# Altium schematic sheet NB2DSK_Mounts.SchDoc: NB2DSK01 Holes and Graphics
size A4; Organization: Altium Limited.; Address1: Level 3, 12a Rodborough Rd; Address2: Frenchs Forest 2086; Address3: NSW; Address4: AUSTRALIA; DocumentNumber: 38; Revision: 6; SheetNumber: 38; SheetTotal: 64
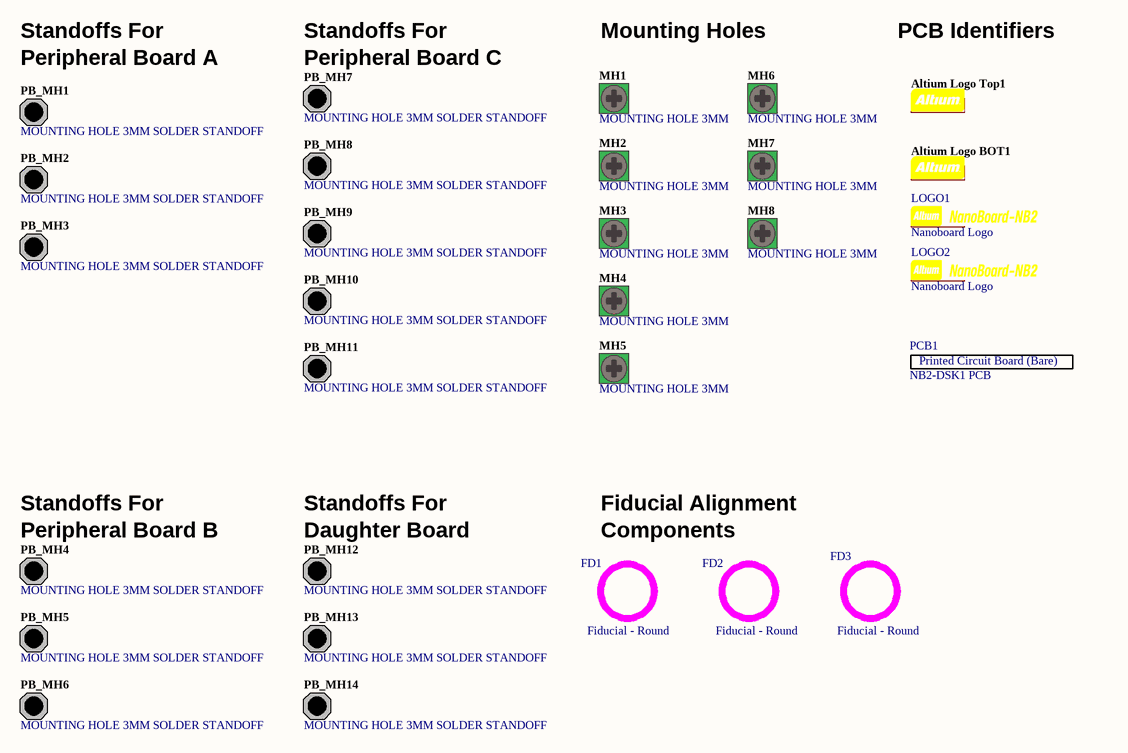
[diagram p0: NB2DSK_Mounts.SchDoc]

## Parts
Altium_Logo_BOT1  Altium  [Logo-Altium]  (value not drawn)  (no BOM)
Altium_Logo_Top1  Altium  [Logo-Altium]  (value not drawn)  (no BOM)
FD1  Fiducial - Round  [FIDUCIAL ROUND]
FD2  Fiducial - Round  [FIDUCIAL ROUND]
FD3  Fiducial - Round  [FIDUCIAL ROUND]
LOGO1  Nanoboard Logo  [NANOBOARD LOGO]  (no BOM)
LOGO2  Nanoboard Logo  [NANOBOARD LOGO]  (no BOM)
MH1  MOUNTING HOLE 3MM  [MOUNTING_HOLE_3MM]  (no BOM)
MH2  MOUNTING HOLE 3MM  [MOUNTING_HOLE_3MM]  (no BOM)
MH3  MOUNTING HOLE 3MM  [MOUNTING_HOLE_3MM]  (no BOM)
MH4  MOUNTING HOLE 3MM  [MOUNTING_HOLE_3MM]  (no BOM)
MH5  MOUNTING HOLE 3MM  [MOUNTING_HOLE_3MM]  (no BOM)
MH6  MOUNTING HOLE 3MM  [MOUNTING_HOLE_3MM]  (no BOM)
MH7  MOUNTING HOLE 3MM  [MOUNTING_HOLE_3MM]  (no BOM)
MH8  MOUNTING HOLE 3MM  [MOUNTING_HOLE_3MM]  (no BOM)
PB_MH1  MOUNTING HOLE 3MM SOLDER STANDOFF  [STANDOFF_SOLDER_3MM]  (no BOM)
PB_MH2  MOUNTING HOLE 3MM SOLDER STANDOFF  [STANDOFF_SOLDER_3MM]  (no BOM)
PB_MH3  MOUNTING HOLE 3MM SOLDER STANDOFF  [STANDOFF_SOLDER_3MM]  (no BOM)
PB_MH4  MOUNTING HOLE 3MM SOLDER STANDOFF  [STANDOFF_SOLDER_3MM]  (no BOM)
PB_MH5  MOUNTING HOLE 3MM SOLDER STANDOFF  [STANDOFF_SOLDER_3MM]  (no BOM)
PB_MH6  MOUNTING HOLE 3MM SOLDER STANDOFF  [STANDOFF_SOLDER_3MM]  (no BOM)
PB_MH7  MOUNTING HOLE 3MM SOLDER STANDOFF  [STANDOFF_SOLDER_3MM]  (no BOM)
PB_MH8  MOUNTING HOLE 3MM SOLDER STANDOFF  [STANDOFF_SOLDER_3MM]  (no BOM)
PB_MH9  MOUNTING HOLE 3MM SOLDER STANDOFF  [STANDOFF_SOLDER_3MM]  (no BOM)
PB_MH10  MOUNTING HOLE 3MM SOLDER STANDOFF  [STANDOFF_SOLDER_3MM]  (no BOM)
PB_MH11  MOUNTING HOLE 3MM SOLDER STANDOFF  [STANDOFF_SOLDER_3MM]  (no BOM)
PB_MH12  MOUNTING HOLE 3MM SOLDER STANDOFF  [STANDOFF_SOLDER_3MM]  (no BOM)
PB_MH13  MOUNTING HOLE 3MM SOLDER STANDOFF  [STANDOFF_SOLDER_3MM]  (no BOM)
PB_MH14  MOUNTING HOLE 3MM SOLDER STANDOFF  [STANDOFF_SOLDER_3MM]  (no BOM)
PCB1  NB2-DSK1 PCB

## Nets

Not connected (* = marked no-connect by the designer): MH1 1; MH2 1; MH3 1; MH4 1; MH5 1; MH6 1; MH7 1; MH8 1; PB_MH1 1; PB_MH2 1; PB_MH3 1; PB_MH4 1; PB_MH5 1; PB_MH6 1; PB_MH7 1; PB_MH8 1; PB_MH9 1; PB_MH10 1; PB_MH11 1; PB_MH12 1; PB_MH13 1; PB_MH14 1

## Notes on the sheet
- Standoffs For
- Mounting Holes
- PCB Identifiers
- (near PB_MH1) Peripheral Board A
- (near PB_MH7) Peripheral Board C
- Fiducial Alignment
- (near PB_MH4) Peripheral Board B
- (near PB_MH12) Daughter Board
- Components
- Sheet Title
- Project Title
- Size:
- Date:
- A4
- Assy:
- Time:
- Sheet
- Revision:
- of
- File:
- (in symbol D-000-0014) Printed Circuit Board (Bare)

## Library data of the parts
Altium_Logo_BOT1 Altium_Logo_Top1 = D-000-0003: Altium Logo for PCB; Category: Graphic-PCB; Status: Production
FD1-FD3 = D-004-0001: Fiducial - Round 1.5mm Top-Bottom; Status: Unreleased; Category: Fiducial
LOGO1 LOGO2 = D-000-0000: Status: Production; Category: Graphic-PCB
MH1-MH8 = D-001-0001: Mounting Hole, M3 Screw, Plated, Square Pad; Category: Mounting-Hole; Status: Production
PB_MH1-PB_MH14 = D-001-0006: Mounting Hole for Solder Standoff, M3 Screw, Plated, Round Pad; Category: Mounting-Hole; Status: Production
PCB1 = D-000-0014: PCB, NB2 Desktop (NB2-DSK1); Status: Unreleased; Category: Graphic-PCB